# EAGLE design Mechaduino01 (EAGLE 7.7.0)
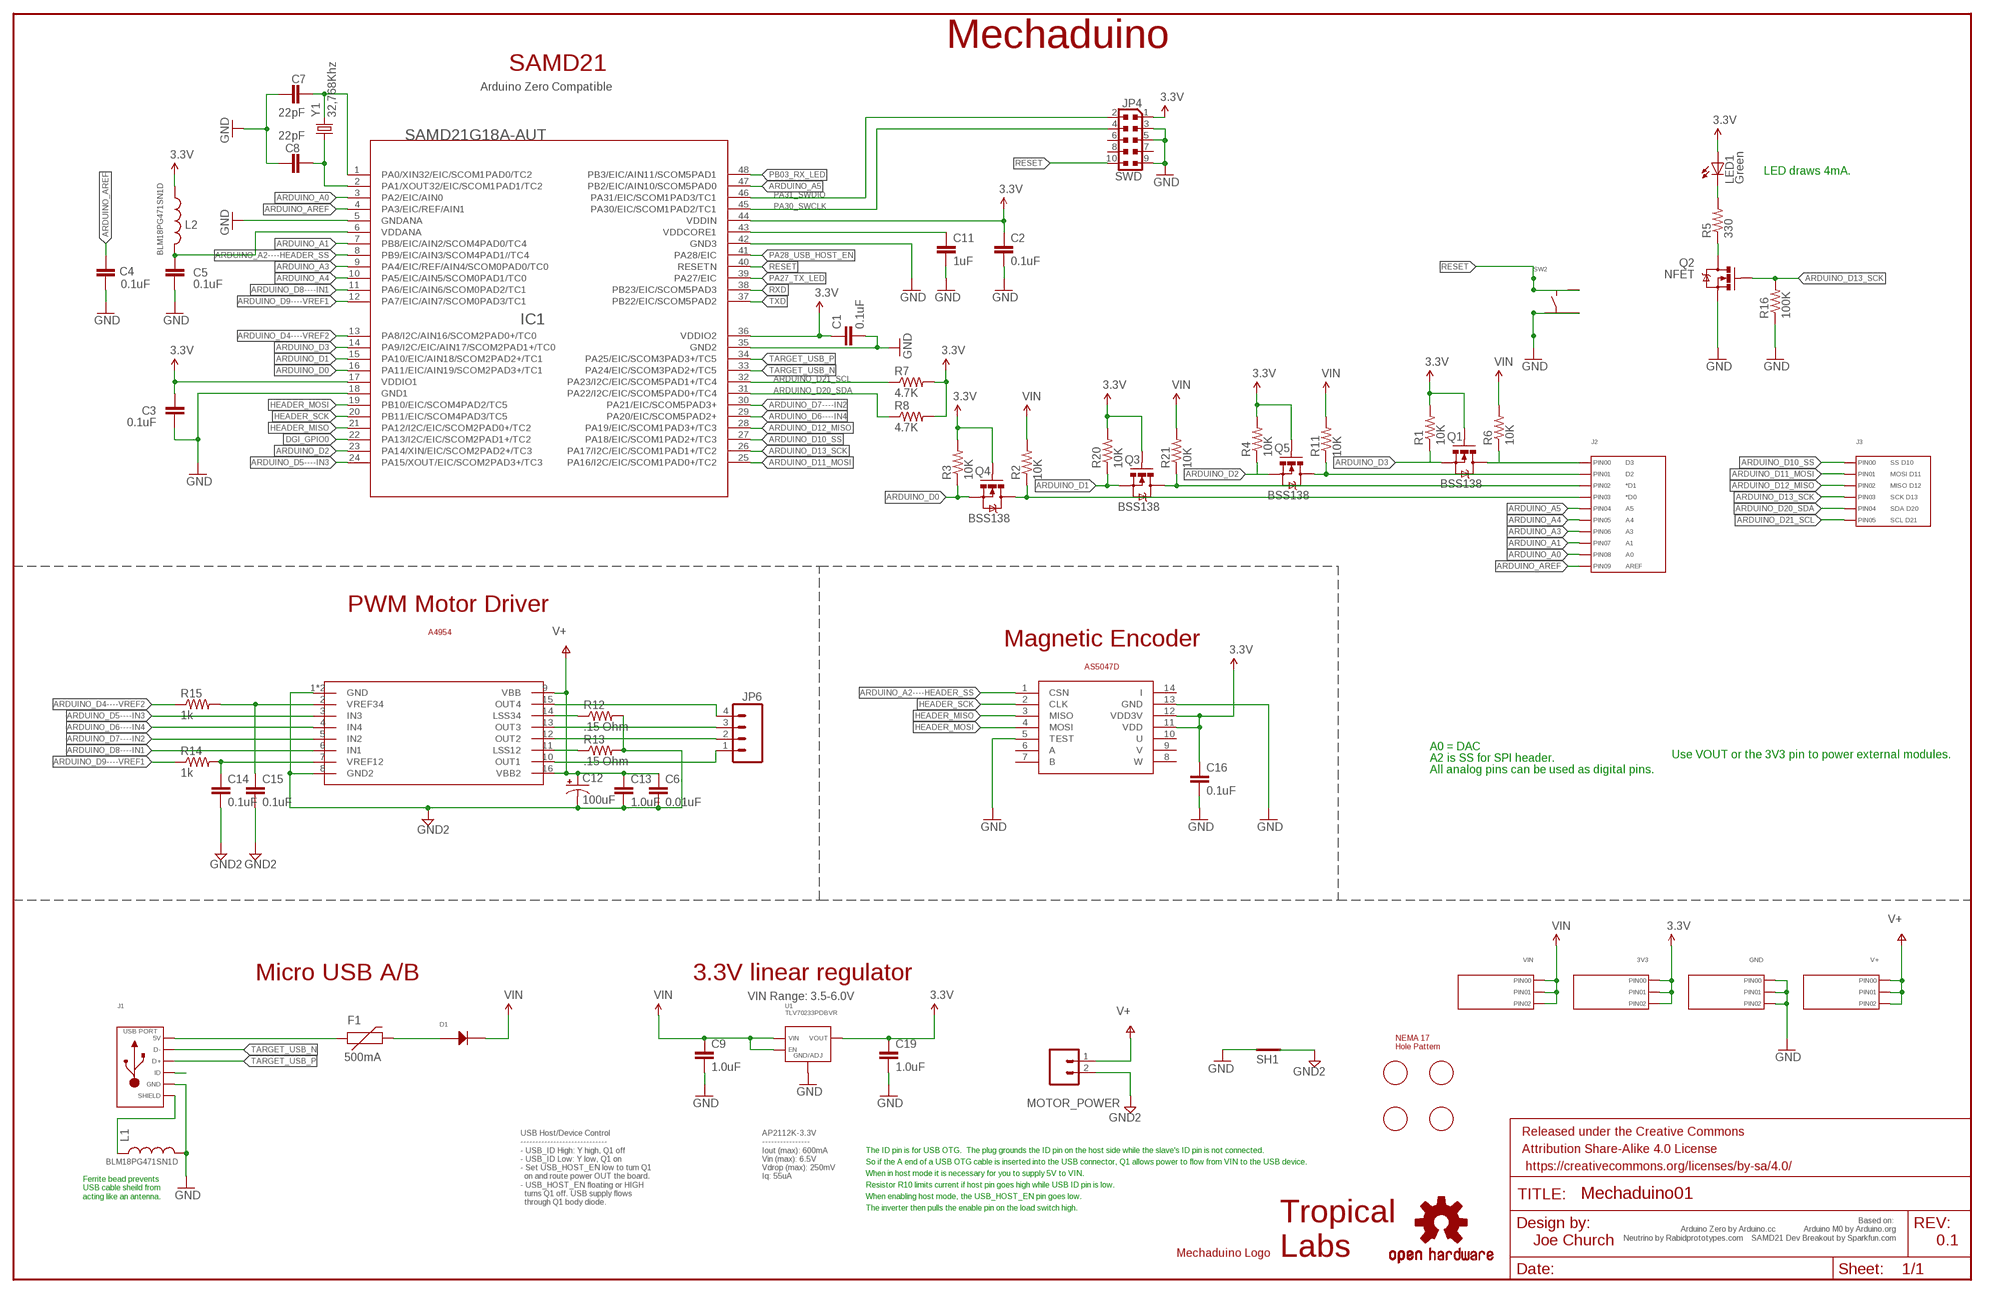
[diagram p0: schematic, sheet 1]

## Parts
3V3  HEADER_01X03_PTH_2.54MM  [PTH_2.54MM_01X03]
C1  0.1uF  CAP0402  [0402-CAP]
C2  0.1uF  CAP0402  [0402-CAP]
C3  0.1uF  CAP0402  [0402-CAP]
C4  0.1uF  CAP0402  [0402-CAP]
C5  0.1uF  CAP0402  [0402-CAP]
C6  0.01uF  CAP0402  [0402-CAP]
C7  22pF  CAP0402  [0402-CAP]
C8  22pF  CAP0402  [0402-CAP]
C9  1.0uF  CAP0402  [0402-CAP]
C11  1uF  CAP0402  [0402-CAP]
C12  100uF  CAP_POLD  [PANASONIC_D]
C13  1.0uF  CAP0603  [0603-CAP]
C14  0.1uF  CAP0402  [0402-CAP]
C15  0.1uF  CAP0402  [0402-CAP]
C16  0.1uF  CAP0402  [0402-CAP]
C19  1.0uF  CAP0402  [0402-CAP]
D1  DIODE_SOD-123  [SOD-123]
F1  500mA  PTCSMD  [PTC-1206]
FRAME1  FRAME-LEDGER  [CREATIVE_COMMONS]
GND  HEADER_01X03_PTH_2.54MM  [PTH_2.54MM_01X03]
IC1  SAMD21G18A-AUT  INTEGRATEDCIRCUITS_1792_SAMD21G18A-AUT  [INTEGRATEDCIRCUITS_TQFP48-7X7]
J1  USB_MICRO_RIGHT  [MICROUSB-RIGHT]
J2  HEADER_01X10_PTH_2.54MM  [PTH_2.54MM_01X10]
J3  HEADER_01X06_PTH_2.54MM  [PTH_2.54MM_01X06]
JP4  SWD  CONNETTORI_0171_PH127-205DF055G00A  [CONNETTORI_PINHEAD-2X5-P127]
JP6  M04PTH  [1X04]
L1  BLM18PG471SN1D  INDUCTOR0603-TDK  [0603-TDK]
L2  BLM18PG471SN1D  INDUCTOR0603-TDK  [0603-TDK]
LED1  Green  0044_KPT-2012YC  [CHIPLED_0805]
LOGO4  OSHW-LOGOL-COPPER  [OSHW-LOGO-L_COPPER]
MOTOR_POWER  M025MM  [SCREWTERMINAL-5MM-2]
Q1  BSS138  MOSFET-NCHANNELSMD  [SOT23-3]
Q2  NFET  MOSFET-NCHANNEL2N7002PW  [SOT323]
Q3  BSS138  MOSFET-NCHANNELSMD  [SOT23-3]
Q4  BSS138  MOSFET-NCHANNELSMD  [SOT23-3]
Q5  BSS138  MOSFET-NCHANNELSMD  [SOT23-3]
R1  10K  R-US_R0402-VISHAY  [R0402-VISHAY]
R2  10K  R-US_R0402-VISHAY  [R0402-VISHAY]
R3  10K  R-US_R0402-VISHAY  [R0402-VISHAY]
R4  10K  R-US_R0402-VISHAY  [R0402-VISHAY]
R5  330  R-US_R0402-VISHAY  [R0402-VISHAY]
R6  10K  R-US_R0402-VISHAY  [R0402-VISHAY]
R7  4.7K  R-US_R0402-VISHAY  [R0402-VISHAY]
R8  4.7K  R-US_R0402-VISHAY  [R0402-VISHAY]
R11  10K  R-US_R0402-VISHAY  [R0402-VISHAY]
R12  .15 Ohm  R-US_R1206  [R1206]
R13  .15 Ohm  R-US_R1206  [R1206]
R14  1k  R-US_R0402-VISHAY  [R0402-VISHAY]
R15  1k  R-US_R0402-VISHAY  [R0402-VISHAY]
R16  100K  R-US_R0402-VISHAY  [R0402-VISHAY]
R20  10K  R-US_R0402-VISHAY  [R0402-VISHAY]
R21  10K  R-US_R0402-VISHAY  [R0402-VISHAY]
SH1  SHORT-HA5  [SHORT_ALL-50]
SW2  TACT_4.2MM  [TACT4.2MM]
U1  TLV70233PDBVR  [SOT-23-5]
U$1  AVAGO_DRIVERTHERM  [TSSOP16_THERM]
U$2  NEMA17_HOLE_PATTERNNEW  [NEMA17_HOLE_PATTERN_2]
U$3  TROPICAL_LABS_LOGO_1LOGO3  [LOGO3]
U$4  AS5047D  [TSSOP14]
U$5  MECHADUINO_LOGO  [MECHADUINO_LOGO]
V+  HEADER_01X03_PTH_2.54MM  [PTH_2.54MM_01X03]
VIN  HEADER_01X03_PTH_2.54MM  [PTH_2.54MM_01X03]
Y1  32,768Khz  CRYSTAL2012  [CRYSTAL-SMD-2.0X1.2]

## Nets
3.3V: 3V3.P$1(PIN0) 3V3.P$2(PIN1) 3V3.P$3(PIN2) C1.1 C2.1 C3.2 C16.1 C19.1 IC1.17(VDDIO1) IC1.36(VDDIO2) IC1.44(VDDIN) JP4.1 L2.1 LED1.A Q1.1(G) Q3.1(G) Q4.1(G) Q5.1(G) R1.2 R3.2 R4.2 R7.2 R8.2 R20.2 U1.P$5(VOUT) U$4.11(VDD) U$4.12(VDD3V)
ARDUINO_A0: IC1.3(PA2/EIC/AIN0) J2.P$9(PIN8)
ARDUINO_A1: IC1.7(PB8/EIC/AIN2/SCOM4PAD0/TC4) J2.P$8(PIN7)
ARDUINO_A2----HEADER_SS: IC1.8(PB9/EIC/AIN3/SCOM4PAD1//TC4) U$4.1(CSN)
ARDUINO_A3: IC1.9(PA4/EIC/REF/AIN4/SCOM0PAD0/TC0) J2.P$7(PIN6)
ARDUINO_A4: IC1.10(PA5/EIC/AIN5/SCOM0PAD1/TC0) J2.P$6(PIN5)
ARDUINO_A5: IC1.47(PB2/EIC/AIN10/SCOM5PAD0) J2.P$5(PIN4)
ARDUINO_AREF: C4.1 IC1.4(PA3/EIC/REF/AIN1) J2.P$10(PIN9)
ARDUINO_D0: IC1.16(PA11/EIC/AIN19/SCOM2PAD3+/TC1) Q4.2(S) R3.1
ARDUINO_D1: IC1.15(PA10/EIC/AIN18/SCOM2PAD2+/TC1) Q3.2(S) R20.1
ARDUINO_D2: IC1.23(PA14/XIN/EIC/SCOM2PAD2+/TC3) Q5.2(S) R4.1
ARDUINO_D3: IC1.14(PA9/I2C/EIC/AIN17/SCOM2PAD1+/TC0) Q1.2(S) R1.1
ARDUINO_D4----VREF2: IC1.13(PA8/I2C/AIN16/SCOM2PAD0+/TC0) R15.1
ARDUINO_D5----IN3: IC1.24(PA15/XOUT/EIC/SCOM2PAD3+/TC3) U$1.3(IN3)
ARDUINO_D6----IN4: IC1.29(PA20/EIC/SCOM5PAD2+) U$1.4(IN4)
ARDUINO_D7----IN2: IC1.30(PA21/EIC/SCOM5PAD3+) U$1.5(IN2)
ARDUINO_D8----IN1: IC1.11(PA6/EIC/AIN6/SCOM0PAD2/TC1) U$1.6(IN1)
ARDUINO_D9----VREF1: IC1.12(PA7/EIC/AIN7/SCOM0PAD3/TC1) R14.1
ARDUINO_D10_SS: IC1.27(PA18/EIC/SCOM1PAD2+/TC3) J3.P$1(PIN0)
ARDUINO_D11_MOSI: IC1.25(PA16/I2C/EIC/SCOM1PAD0+/TC2) J3.P$2(PIN1)
ARDUINO_D12_MISO: IC1.28(PA19/EIC/SCOM1PAD3+/TC3) J3.P$3(PIN2)
ARDUINO_D13_SCK: IC1.26(PA17/I2C/EIC/SCOM1PAD1+/TC2) J3.P$4(PIN3) Q2.1(G) R16.2
ARDUINO_D20_SDA: IC1.31(PA22/I2C/EIC/SCOM5PAD0+/TC4) J3.P$5(PIN4) R8.1
ARDUINO_D21_SCL: IC1.32(PA23/I2C/EIC/SCOM5PAD1+/TC4) J3.P$6(PIN5) R7.1
DGI_GPIO0: IC1.22(PA13/I2C/EIC/SCOM2PAD1+/TC2)
GND [gnd]: C1.2 C2.2 C3.1 C4.2 C5.2 C7.1 C8.1 C9.2 C11.2 C16.2 C19.2 GND.P$1(PIN0) GND.P$2(PIN1) GND.P$3(PIN2) IC1.5(GNDANA) IC1.18(GND1) IC1.35(GND2) IC1.42(GND3) J1.5(GND) JP4.3 JP4.5 JP4.9 L1.2 Q2.2(S) R16.1 SH1.2 SW2.P$3 SW2.P$4 U1.P$2(GND/ADJ) U$4.5(TEST) U$4.13(GND)
GND2 [gnd]: C6.2 C12.- C13.2 C14.2 C15.2 MOTOR_POWER.2 R12.2 R13.2 SH1.1 U$1.1(GND) U$1.8(GND2) U$1.P$1(GND)
HEADER_MISO: IC1.21(PA12/I2C/EIC/SCOM2PAD0+/TC2) U$4.3(MISO)
HEADER_MOSI: IC1.19(PB10/EIC/SCOM4PAD2/TC5) U$4.4(MOSI)
HEADER_SCK: IC1.20(PB11/EIC/SCOM4PAD3/TC5) U$4.2(CLK)
HV1: J2.P$3(PIN2) Q3.3(D) R21.1
HV2: J2.P$4(PIN3) Q4.3(D) R2.1
HV3: J2.P$2(PIN1) Q5.3(D) R11.1
HV4: J2.P$1(PIN0) Q1.3(D) R6.1
N$1: LED1.C R5.2
N$2: R12.1 U$1.14(LSS34)
N$3: Q2.3(D) R5.1
N$4: R13.1 U$1.11(LSS12)
N$6: C15.1 R15.2 U$1.2(VREF34)
N$7: J1.4(ID)
N$13: JP6.4 U$1.15(OUT4)
N$14: JP6.1 U$1.10(OUT1)
N$15: JP6.2 U$1.12(OUT2)
N$16: JP6.3 U$1.13(OUT3)
N$32: C14.1 R14.2 U$1.7(VREF12)
N$33: D1.ANODE F1.2
N$36 [usbvcc]: F1.1 J1.1(5V)
PA00_XIN32: C7.2 IC1.1(PA0/XIN32/EIC/SCOM1PAD0/TC2) Y1.2
PA01_XOUT32: C8.2 IC1.2(PA1/XOUT32/EIC/SCOM1PAD1/TC2) Y1.1
PA27_TX_LED: IC1.39(PA27/EIC)
PA28_USB_HOST_EN: IC1.41(PA28/EIC)
PA30_SWCLK: IC1.45(PA30/EIC/SCOM1PAD2/TC1) JP4.4
PA31_SWDIO: IC1.46(PA31/EIC/SCOM1PAD3/TC1) JP4.2
PB03_RX_LED: IC1.48(PB3/EIC/AIN11/SCOM5PAD1)
RESET: IC1.40(RESETN) JP4.10 SW2.P$1 SW2.P$2
RXD: IC1.38(PB23/EIC/SCOM5PAD3)
SHIELD [gnd]: J1.S1(SLD) J1.S2(SLD) J1.S3(SLD) J1.S4(SLD) J1.S5(SLD) J1.S6(SLD) J1.S7(SLD) J1.S8(SLD) L1.1
TARGET_USB_N [USBpair]: IC1.33(PA24/EIC/SCOM3PAD2+/TC5) J1.2(D-)
TARGET_USB_P [USBpair]: IC1.34(PA25/EIC/SCOM3PAD3+/TC5) J1.3(D+)
TXD: IC1.37(PB22/EIC/SCOM5PAD2)
V+: C6.1 C12.+ C13.1 MOTOR_POWER.1 U$1.9(VBB) U$1.16(VBB2) V+.P$1(PIN0) V+.P$2(PIN1) V+.P$3(PIN2)
VDDANA: C5.1 IC1.6(VDDANA) L2.2
VDDCORE: C11.1 IC1.43(VDDCORE1)
VIN [usbvcc]: C9.1 D1.CATHODE R2.2 R6.2 R11.2 R21.2 U1.P$1(VIN) U1.P$3(EN) VIN.P$1(PIN0) VIN.P$2(PIN1) VIN.P$3(PIN2)
Unconnected: JP4.6 JP4.7 JP4.8 U$4.6(A) U$4.7(B) U$4.8(W) U$4.9(V) U$4.10(U) U$4.14(I)

## Notes on the sheet
- Mechaduino
- SAMD21
- Arduino Zero Compatible
- LED draws 4mA.
- PWM Motor Driver
- A4954
- Magnetic Encoder
- A0 = DAC | Use VOUT or the 3V3 pin to power external modules.
- A2 is SS for SPI header.
- All analog pins can be used as digital pins.
- Micro USB A/B | 3.3V linear regulator
- VIN Range: 3.5-6.0V
- USB Host/Device Control
  -----------------------------
  - USB_ID High: Y high, Q1 off
  - USB_ID Low: Y low, Q1 on
  - Set USB_HOST_EN low to turn Q1
    on and route power OUT the board.
  - USB_HOST_EN floating or HIGH
    turns Q1 off. USB supply flows
    through Q1 body diode.
- AP2112K-3.3V
  ----------------
  Iout (max): 600mA 
  Vin (max): 6.5V
  Vdrop (max): 250mV
  Iq: 55uA
- The ID pin is for USB OTG.  The plug grounds the ID pin on the host side while the slave's ID pin is not connected.
- So if the A end of a USB OTG cable is inserted into the USB connector, Q1 allows power to flow from VIN to the USB device.
- When in host mode it is necessary for you to supply 5V to VIN.
- Resistor R10 limits current if host pin goes high while USB ID pin is low.
- Ferrite bead prevents 
  USB cable sheild from 
  acting like an antenna.
- When enabling host mode, the USB_HOST_EN pin goes low.
- The inverter then pulls the enable pin on the load switch high.
- Based on: 
  Arduino Zero by Arduino.cc              Arduino M0 by Arduino.org
  Neutrino by Rabidprototypes.com    SAMD21 Dev Breakout by Sparkfun.com
- Joe Church | 0.1

## Library data of the parts
3V3 GND V+ VIN = MF_Connectors:HEADER_01X03: Library: MF_Connectors Description: Header Connector with 03 Positions and 01 Rows. Use the LABEL Attribute to label the pin on the schematic and PCB. You can remove the attributes on the PCB by using the SMASH function on the part and then deleting the text.
C1-C9 C11 C13-C16 C19 = swift:CAP: Capacitor Standard 0603 ceramic capacitor, and 0.1" leaded capacitor.
C12 = SparkFun-Capacitors:CAP_POL: Capacitor Polarized These are standard SMD and PTH capacitors. Normally 10uF, 47uF, and 100uF in electrolytic and tantalum varieties. Always verify the external diameter of the through hole cap, it varies with capacity, voltage, and manufacturer. The EIA devices should be standard.
D1 = MF_Discrete_Semiconductor:DIODE: Library: MF_Discrete_Semiconductor Description: Device for Single Packaged Diodes. Manufacture part number (MFG#) can be added via Attributes.; MFG#: N/A
F1 = SparkFun-PowerIC:PTC: Resettable Fuse PTC Resettable Fuse. Spark Fun Electronics SKU : COM-08357; PROD_ID: RES-11150
FRAME1 = SparkFun-Aesthetics:FRAME-LEDGER: Schematic Frame Standard 11x14 US Ledger frame
IC1 = Arduino-Neutrino-082:INTEGRATEDCIRCUITS_1792_SAMD21G18A-AUT: Atmel D21 32bit ARM Cortex-M0 microcontroller - 48 PIN TQFP 256KB flash memory + 32KB SRAM
J1 = MF_Connectors:USB: Library: MF_Connectors Description: 5 Pin USB Connectors. SLD is the shield connection. Usually tied to ground through a small ferrite bead.
J2 = MF_Connectors:HEADER_01X10: Library: MF_Connectors Description: Header Connector with 10 Positions and 01 Rows. Use the LABEL Attribute to label the pin on the schematic and PCB. You can remove the attributes on the PCB by using the SMASH function on the part and then deleting the text.; LABEL00: D3; LABEL01: D2; LABEL02: *D1; LABEL03: *D0; LABEL04: A5; LABEL05: A4; LABEL06: A3; LABEL07: A1; LABEL08: A0; LABEL09: AREF
J3 = MF_Connectors:HEADER_01X06: Library: MF_Connectors Description: Header Connector with 6 Positions and 01 Rows. Use the LABEL Attribute to label the pin on the schematic and PCB. You can remove the attributes on the PCB by using the SMASH function on the part and then deleting the text.; LABEL00: SS D10; LABEL01: MOSI D11; LABEL02: MISO D12; LABEL03: SCK D13; LABEL04: SDA D20; LABEL05: SCL D21
JP4 = Arduino-Neutrino-082:CONNETTORI_0171_PH127-205DF055G00A: 2x5 PASSO 1,27; VALUE: PINHEAD-2x5-P1.27
JP6 = SparkFun-Connectors:M04: Header 4 Standard 4-pin 0.1" header. Use with straight break away headers (SKU : PRT-00116), right angle break away headers (PRT-00553), swiss pins (PRT-00743), machine pins (PRT-00117), and female headers (PRT-00115). Molex polarized connector foot print use with SKU : PRT-08231 with associated crimp pins and housings. 1MM SMD Version SKU: PRT-10208
L1 L2 = SparkFun-Passives:INDUCTOR: Inductors Basic Inductor/Choke - 0603 and 1206. Footprints are not proven and vary greatly between part numbers. SRN6045- 33uH, 20% 1.4A SDR0403-560KL - 56uH, 10%, 500mA RMS/740mA peak
LED1 = Opto:0044_KPT-2012YC: LED YELLOW - SMD - 0805; MONTHLY_USAGE: _____; PART_NUMBER: KPT-2012YC; PRICE: _____; SUPPLIER: _____; TYPE: Opto; VALUE: Yellow
LOGO4 = SparkFun-Aesthetics:OSHW-LOGO: Open Source Hardware Logo This logo indicates the piece of hardware it is found on incorporates a OSHW license and/or adheres to the definition of open source hardware found here: http://freedomdefined.org/OSHW
MOTOR_POWER = SparkFun-Connectors:M02: Standard 2-pin 0.1" header. Use with - straight break away headers ( PRT-00116) - right angle break away headers (PRT-00553) - swiss pins (PRT-00743) - machine pins (PRT-00117) - female headers (PRT-00115) Molex polarized connector foot print use with: PRT-08233 with associated crimp pins and housings. 2.54_SCREWTERM for use with PRT-10571. 3.5mm Screw Terminal footprints for PRT-08084 5mm Screw Terminal footprints for use with PRT-08432; STOREFRONT_ID: PRT-08432
Q1 Q3-Q5 = SparkFun:MOSFET-NCHANNEL
Q2 = SparkFun-DiscreteSemi:MOSFET-NCHANNEL: Common NMOSFET Parts MFG P/N Store ID Prod ID FDD8780 TRANS-09984 SI7820DN TRANS-11055 FDS6630A IC-08089 2N7002PW TRANS-11151 FQP30N06L COM-10213 TRANS-10060 BSS123LT1G TRANS-08345 BSS138 TRANS-00830 BS170 2N7000; PROD_ID: TRANS-11151
R1-R8 R11-R16 R20 R21 = adafruit:R-US_: RESISTOR, American symbol
SH1 = shorts-old:SHORT-H: Short between two nets; BOM: no
SW2 = MF_Switches:TACT: Library: MF_Switches Description: Device for Tact Switches. Manufacture part number (MFG#) can be added via Attributes.
U1 = MF_IC_Power:TLV702: Manufacturer Part #: TLV702 Manufacturer: Texas Instruments Description: LDO Voltage Regulators
U$1 = avagopack:AVAGO_DRIVER
U$2 = stepper_servo_prototype_1:NEMA17_HOLE_PATTERN
U$3 = stepper_servo_prototype_1:TROPICAL_LABS_LOGO_1
U$4 = stepper_servo_prototype_1:AS5047D
U$5 = stepper_servo_prototype_1:MECHADUINO_LOGO
Y1 = SparkFun-FreqCtrl:CRYSTAL: Various standard crystals. Proven footprints. Spark Fun Electronics SKU : COM-00534

## Net classes
2 gnd: width 0.152 mm, drill 0.305 mm, clearance 0.152 mm
3 usbvcc: width 0.152 mm, drill 0.305 mm, clearance 0.152 mm
4 USBpair: width 0.152 mm, drill 0.305 mm, clearance 0.152 mm

## Board
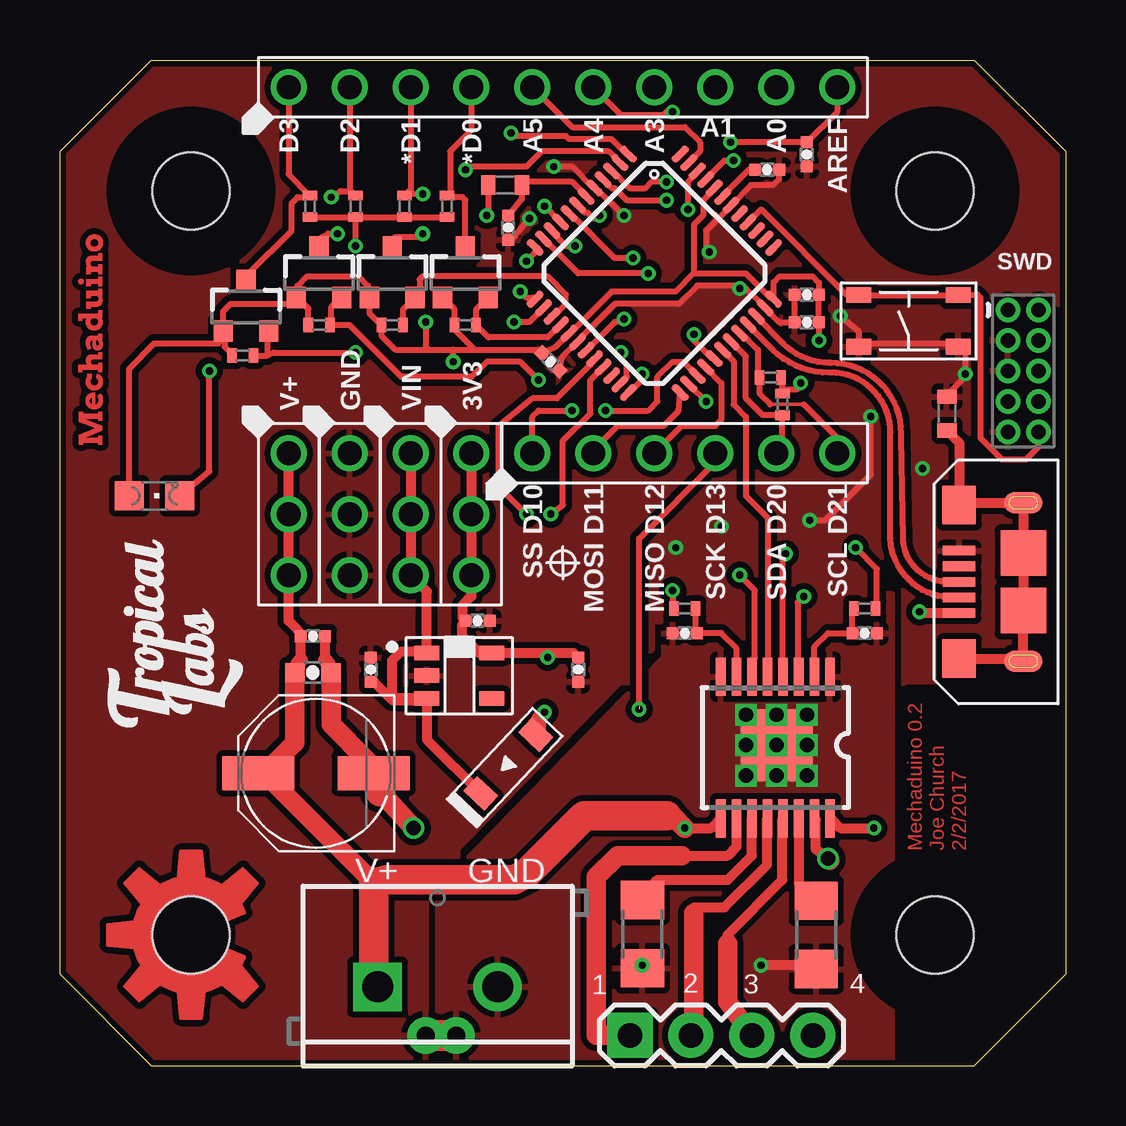
[diagram p1: board, top side]
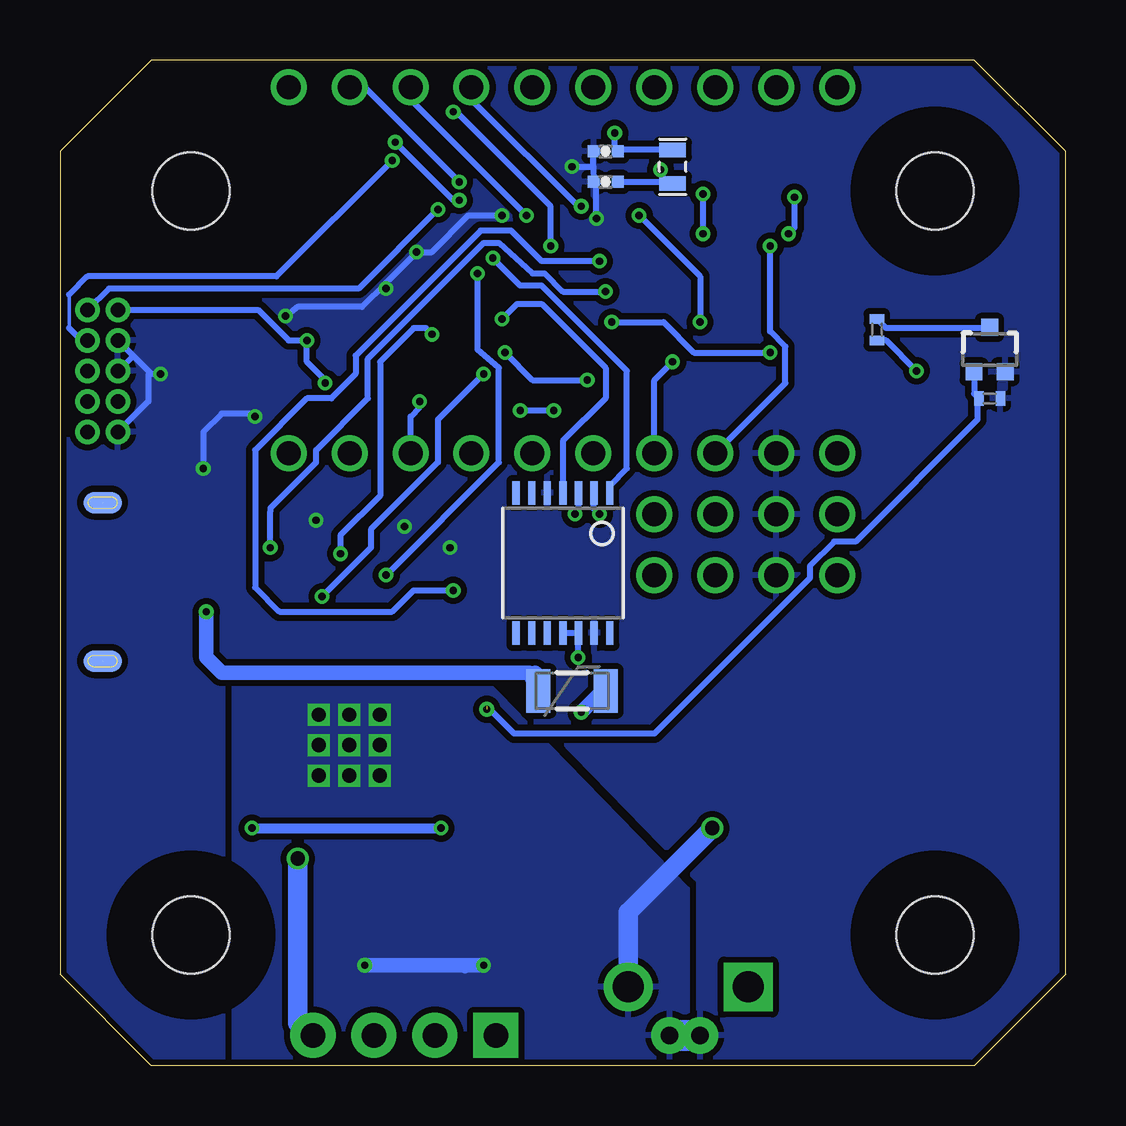
[diagram p2: board, bottom side, seen from below]

Size 41.91 x 41.91 mm. Coordinates in mm from the lower left corner, seen from the top.
Outline: 3.81,0 38.1,0 41.91,3.81 41.91,38.1 38.1,41.91 3.81,41.91 0,38.1 0,3.81 3.81,0
Copper layers (1*16): Top 0.035mm / dielectric 0.2mm / Bottom 0.035mm
Design rules "MacroFabDRU": minimum track width 6mil, minimum drill 12mil, track to track 6mil, track to pad 6mil, pad to pad 6mil, via to via 6mil, smd to smd 0mil, copper to edge 10mil, drill to drill 10mil, minimum pad ring 6mil, minimum via ring 6mil, stop-mask expansion 2mil, vias tented up to drill 25mil, thermal gap 10mil

### Footprints (pad centres in the part's own frame; a part is rotated, then mirrored left to right if it is on the bottom)
PTH_2.54MM_01X03 = drill 1: P$1 -2.54,0; P$2 0,0; P$3 2.54,0
0402-CAP = smd 0.5 x 0.5: 1 -0.5,0; 2 0.5,0
PANASONIC_D = smd 3 x 1.4: + 2.4,0; - -2.4,0
0603-CAP = smd 0.8 x 0.8: 1 -0.75,0; 2 0.75,0
SOD-123 = smd 0.85 x 1.2: ANODE 1.675,0; CATHODE -1.675,0
PTC-1206 = smd 1 x 1.8: 1 -1.4,0; 2 1.4,0
INTEGRATEDCIRCUITS_TQFP48-7X7 = smd 0.85 x 0.32: 1 -4.275,2.75; 2 -4.275,2.25; 3 -4.275,1.75; 4 -4.275,1.25; 5 -4.275,0.75; 6 -4.275,0.25; 7 -4.275,-0.25; 8 -4.275,-0.75; 9 -4.275,-1.25; 10 -4.275,-1.75; 11 -4.275,-2.25; 12 -4.275,-2.75; 25 4.275,-2.75; 26 4.275,-2.25; 27 4.275,-1.75; 28 4.275,-1.25; 29 4.275,-0.75; 30 4.275,-0.25; 31 4.275,0.25; 32 4.275,0.75; 33 4.275,1.25; 34 4.275,1.75; 35 4.275,2.25; 36 4.275,2.75 | smd 0.32 x 0.85: 13 -2.75,-4.275; 14 -2.25,-4.275; 15 -1.75,-4.275; 16 -1.25,-4.275; 17 -0.75,-4.275; 18 -0.25,-4.275; 19 0.25,-4.275; 20 0.75,-4.275; 21 1.25,-4.275; 22 1.75,-4.275; 23 2.25,-4.275; 24 2.75,-4.275; 37 2.75,4.275; 38 2.25,4.275; 39 1.75,4.275; 40 1.25,4.275; 41 0.75,4.275; 42 0.25,4.275; 43 -0.25,4.275; 44 -0.75,4.275; 45 -1.25,4.275; 46 -1.75,4.275; 47 -2.25,4.275; 48 -2.75,4.275
MICROUSB-RIGHT = smd 0.4 x 1.35: 1 -1.3,1.27; 2 -0.65,1.27; 3 0,1.27; 4 0.65,1.27; 5 1.3,1.27 | smd 0.9 x 1.6: S1 -3.3,-1.4; S2 3.3,-1.4 | smd 1.6 x 1.4: S3 -3.2,1.27; S4 3.2,1.27 | smd 1.9 x 1.9: S5 -1.2,-1.405; S6 1.2,-1.405 | smd 0.9 x 1.6 bottom: S7 -3.3,-1.4; S8 3.3,-1.4
PTH_2.54MM_01X10 = drill 1: P$1 -11.43,0; P$2 -8.89,0; P$3 -6.35,0; P$4 -3.81,0; P$5 -1.27,0; P$6 1.27,0; P$7 3.81,0; P$8 6.35,0; P$9 8.89,0; P$10 11.43,0
PTH_2.54MM_01X06 = drill 1: P$1 -6.35,0; P$2 -3.81,0; P$3 -1.27,0; P$4 1.27,0; P$5 3.81,0; P$6 6.35,0
CONNETTORI_PINHEAD-2X5-P127 = drill 0.61 pad 1.016: 1 -0.635,2.54; 2 0.635,2.54; 3 -0.635,1.27; 4 0.635,1.27; 5 -0.635,0; 6 0.635,0; 7 -0.635,-1.27; 8 0.635,-1.27; 9 -0.635,-2.54; 10 0.635,-2.54
1X04 = drill 1.016 pad 1.88 square: 1 0,0 | drill 1.016 pad 1.88: 2 2.54,0; 3 5.08,0; 4 7.62,0
0603-TDK = smd 0.6 x 0.8: 1 -0.7,0; 2 0.7,0
CHIPLED_0805 = smd 1.2 x 1.2: A 0,-1.05; C 0,1.05
SCREWTERMINAL-5MM-2 = drill 1.3 pad 2.032 square: 1 0,0 | drill 1.3 pad 2.032: 2 5,0
SOT23-3 = smd 0.8 x 0.9: 1 -0.95,-1; 2 0.95,-1; 3 0,1.1
SOT323 = smd 0.7 x 0.7: 1 -0.65,-0.925; 2 0.65,-0.925; 3 0,0.925
R0402-VISHAY = smd 0.4 x 0.6: 1 -0.45,0; 2 0.45,0
R1206 = smd 1.6 x 1.803: 1 -1.422,0; 2 1.422,0
SHORT_ALL-50 = drill 0.737 pad 1.524: 1 -0.635,0; 2 0.635,0
TACT4.2MM = smd 1.05 x 0.65: P$1 -2.075,1.075; P$2 2.075,1.075; P$3 -2.075,-1.075; P$4 2.075,-1.075
SOT-23-5 = smd 1.05 x 0.6: P$1 -1.35,0.95; P$2 -1.35,0; P$3 -1.35,-0.95; P$4 1.35,-0.95; P$5 1.35,0.95
TSSOP16_THERM = smd 0.4 x 1.6: 1 -2.225,-2.85; 2 -1.575,-2.85; 3 -0.925,-2.85; 4 -0.275,-2.85; 5 0.375,-2.85; 6 1.025,-2.85; 7 1.675,-2.85; 8 2.325,-2.85; 9 2.325,3.05; 10 1.675,3.05; 11 1.025,3.05; 12 0.375,3.05; 13 -0.275,3.05; 14 -0.925,3.05; 15 -1.575,3.05; 16 -2.225,3.05 | smd 3 x 3: P$1 0,0
NEMA17_HOLE_PATTERN_2 = hole 3.2: -15.5,15.5; -15.5,-15.5; 15.5,-15.5; 15.5,15.5
TSSOP14 = smd 0.305 x 0.991: 1 -1.95,-2.918; 2 -1.3,-2.918; 3 -0.65,-2.918; 4 0,-2.918; 5 0.65,-2.918; 6 1.3,-2.918; 7 1.95,-2.918; 8 1.95,2.918; 9 1.3,2.918; 10 0.65,2.918; 11 0,2.918; 12 -0.65,2.918; 13 -1.3,2.918; 14 -1.95,2.918
CRYSTAL-SMD-2.0X1.2 = smd 0.6 x 1.1: 1 -0.7,0; 2 0.7,0

### Placement (x,y rotation side)
3V3  17.14,22.99 270 top
C1  31.11,32.13 180 top
C2  31.11,30.99 180 top
C3  20.45,29.34 135 top
C4  31.11,37.97 270 top
C5  18.67,34.92 270 top
C6  10.54,17.91 0 top
C7  18pF  [0402-CAP]  19.18,38.1 0 bottom
C8  18pF  [0402-CAP]  19.18,36.83 0 bottom
C9  12.95,16.51 90 top
C11  29.46,37.34 0 top
C12  10.67,12.19 180 top
C13  10.54,16.38 0 top
C14  26.04,18.03 180 top
C15  33.53,18.03 0 top
C16  21.59,16.51 270 top
C19  17.4,18.54 0 top
D1  18.67,12.57 46.8 top
F1  20.57,15.62 0 bottom
FRAME1  0.61,-10.16 0 top  (outside the outline)
GND  12.06,22.99 270 top
IC1  24.77,33.02 315 top
J1  38.73,20.17 90 top
J2  20.95,40.77 0 top
J3  26.04,25.53 0 top
JP4  40.13,28.96 0 top
JP6  23.75,1.27 0 top
L1  36.96,27.18 90 top
L2  18.54,36.7 0 top
LED1  3.94,23.75 270 top
LOGO4  5.46,5.46 90 top
MOTOR_POWER  13.23,3.29 0 top
Q1  7.75,31.62 0 top
Q2  3.17,29.84 0 bottom
Q3  13.84,33.02 0 top
Q4  16.89,33.02 0 top
Q5  10.79,33.02 0 top
R1  7.62,29.59 180 top
R2  16.13,35.81 270 top
R3  16.89,30.86 180 top
R4  10.79,30.86 180 top
R5  7.87,30.67 270 bottom
R6  10.41,35.81 270 top
R7  29.59,28.68 0 top
R8  30.1,27.56 90 top
R11  12.32,35.81 270 top
R12  31.51,5.46 270 top
R13  24.27,5.49 270 top
R14  26.04,19.05 0 top
R15  33.53,19.05 180 top
R16  3.17,27.81 180 bottom
R20  13.84,30.86 180 top
R21  14.35,35.81 270 top
SH1  15.88,1.27 180 top
SW2  35.36,31.04 0 top
U1  16.64,16.26 0 top
U$1  29.86,13.36 180 top
U$2  20.95,20.95 0 top
U$3  7.75,13.97 90 top
U$4  20.95,20.95 180 bottom
U$5  1.91,25.78 90 top
V+  9.53,22.99 270 top
VIN  14.61,22.99 270 top
Y1  16.38,37.47 90 bottom

### Tracks (layer width: path | path; a pad name or v marks a point on that pad's centre or on a via)
3.3V  (via drill 0.3, 0.3 pad 0.25)
  Top 0.254: 30.1,28.19 30.1,28.75 R7.2 | v30.86,28.45 30.73,28.19 30.1,28.19 | 30.1,28.19 R8.2 | 31.62,30.99 v31.62,30.23 | C2.1 31.62,30.99 | 31.62,30.99 31.62,32.12 C1.1 31.62,32.14 31.62,32.64 31.37,32.89 29.97,32.89 29.73,32.65 IC1.36 29.72,32 29.59,32 28.57,33.02 26.42,33.02 | Q4.1 16.44,31.52 R3.2 16.44,30.68 17.27,29.84 | 17.27,29.84 19.94,29.84 C3.2 20.63,29.95 IC1.17 21.34,30.61 22.99,32.26 25.65,32.26 26.42,33.02 | R4.2 10.35,31.52 | 10.35,31.52 Q5.1 9.57,31.75 7.11,31.75 6.8,31.43 Q1.1 6.86,30.86 6.86,30.35 | 10.35,31.52 10.35,31.57 9.91,32 9.91,32.51 10.29,32.89 12.45,32.89 12.83,32.51 12.83,32.09 Q3.1 12.89,31.36 R20.2 13.39,30.42 13.97,29.84 15.37,29.84 | 15.37,29.84 16.38,29.84 | 16.38,29.84 17.27,29.84 | L2.1 17.84,35.62 17.72,35.5 | 17.72,35.5 17.65,35.43 | v17.78,35.43 17.72,35.5 | v15.24,30.99 15.24,29.97 15.37,29.84 | 6.86,30.35 6.86,29.97 7.11,29.72 R1.2 | LED1.A 2.89,29.05 3.94,30.1 6.6,30.1 6.86,30.35 | v16.38,29.34 16.38,29.84 | 26.42,33.02 26.42,35.05 26.8,35.43 26.8,36.07 27.18,36.45 IC1.44 | v20.32,17.02 20.32,17.21
  Top 0.406: 3V3.P$1 3V3.P$2 3V3.P$3 17.14,19.56 16.76,19.18 16.76,18.68 C19.1 16.76,18.41 16.76,17.91 17.46,17.21 U1.P$5 20.32,17.21 21.39,17.21 C16.1
  Bottom 0.254: v30.86,28.45 30.86,28.57 31.62,29.34 v31.62,30.23 32.38,30.23 33.66,31.5 JP4.1 | v15.24,30.99 15.24,32.89 v17.78,35.43 | v16.38,29.34 17.14,28.57 3V3.P$1 | v20.32,17.02 20.32,18.03 U$4.12 20.45,18.03 U$4.11
ARDUINO_A0  (via drill 0.3 pad 0.25)
  Top 0.254: IC1.3 22.99,37.34 23.75,36.58 24.38,36.58 24.64,36.83 v25.27,36.83
  Bottom 0.254: v25.27,36.83 29.21,40.77 J2.P$9
ARDUINO_A1  (via drill 0.3 pad 0.25)
  Top 0.254: v22.48,35.43 22.35,35.43 22.23,35.31 21.97,35.56 21.84,35.56 21.59,35.81 IC1.7
  Bottom 0.254: J2.P$8 27.3,40.26 v22.48,35.43
ARDUINO_A2----HEADER_SS  (via drill 0.3 pad 0.25)
  Top 0.254: v23.88,33.66 23.11,33.66 21.34,35.43 IC1.8
  Bottom 0.254: U$4.1 19,24.18 18.29,24.89 18.29,28.96 21.84,32.51 22.73,32.51 v23.88,33.66
ARDUINO_A3  (via drill 0.3 pad 0.25)
  Top 0.254: v20.19,35.81 20.83,35.18 IC1.9
  Bottom 0.254: J2.P$7 24.77,40.26 20.19,35.69 v20.19,35.81
ARDUINO_A4  (via drill 0.3 pad 0.25)
  Top 0.254: v25.53,39.75 25.27,39.75 25.15,39.62 23.37,39.62 J2.P$6 | v21.46,34.16 21.08,34.16 20.45,34.8 IC1.10
  Bottom 0.254: v25.53,39.75 25.4,39.75 21.46,35.81 v21.46,34.16
ARDUINO_A5
  Top 0.254: J2.P$5 21.34,39.12 26.04,39.12 26.67,38.48 26.67,38.1 IC1.47
ARDUINO_AREF  (via drill 0.3 pad 0.25)
  Top 0.254: J2.P$10 32.38,39.74 C4.1 31.11,38.48 v27.94,38.48 | v25.27,36.07 23.62,36.07 23.11,36.58 22.99,36.58 22.73,36.83 IC1.4
  Bottom 0.254: v25.27,36.07 25.53,36.07 v27.94,38.48
ARDUINO_D0
  Top 0.254: Q4.2 17.34,31.52 R3.1 17.85,30.35 20.32,30.35 20.85,30.88 IC1.16
ARDUINO_D1
  Top 0.254: R20.1 14.29,31.52 Q3.2 14.99,32.21 14.99,32.77 15.11,32.89 20.32,32.89 21.08,32.13 21.08,31.75 20.57,31.23 IC1.15 20.44,31.23
ARDUINO_D2  (via drill 0.3 pad 0.25)
  Top 0.254: 23.24,28.32 IC1.23 23.37,28.45 23.62,28.7 23.62,29.21 23.37,29.46 v23.37,29.72 | 11.3,30.86 12.06,30.86 14.22,28.7 17.14,28.7 17.78,29.34 19.18,29.34 v19.94,28.57 | 11.3,30.86 11.3,31.62 11.68,32 Q5.2 | 11.3,30.86 R4.1
  Bottom 0.254: v19.94,28.57 22.23,28.57 v23.37,29.72
ARDUINO_D3  (via drill 0.3 pad 0.25)
  Top 0.254: IC1.14 19.56,30.99 v18.92,30.99 | 8.64,30.86 Q1.2 8.64,30.73 8.64,29.59 | R1.1 8.64,29.59 | 8.64,29.59 8.89,29.72 v12.32,29.72
  Bottom 0.254: v12.32,29.72 15.49,29.72 16.76,30.99 v18.92,30.99
ARDUINO_D4----VREF2  (via drill 0.3 pad 0.25)
  Top 0.254: v33.15,21.59 34.04,20.7 34.04,19.05 R15.1 | v19.18,32.26 19.43,32 19.68,32 IC1.13
  Bottom 0.254: v33.15,21.59 33.15,23.11 33.15,23.24 31.24,25.15 31.24,25.65 29.08,27.81 29.08,29.46 24.26,34.29 23.62,34.29 22.23,33.02 21.72,33.02 20.95,32.26 v19.18,32.26
ARDUINO_D5----IN3  (via drill 0.3 pad 0.25)
  Top 0.254: v24.26,28.83 24.38,28.7 23.75,28.07 IC1.24 | v30.99,19.56 30.73,19.3 30.73,16.26 U$1.3
  Bottom 0.254: v24.26,28.83 26.16,26.92 26.16,25.15 28.96,22.35 28.96,21.59 v30.99,19.56
ARDUINO_D6----IN4  (via drill 0.3 pad 0.25)
  Top 0.254: v26.42,30.48 26.29,30.35 27.18,29.46 IC1.29 | v30.23,21.34 30.1,21.08 30.1,16.26 U$1.4
  Bottom 0.254: v26.42,30.48 26.67,30.73 27.18,30.73 28.57,29.34 28.57,23.75 30.23,22.1 v30.23,21.34
ARDUINO_D7----IN2
  Top 0.254: 29.46,16.26 U$1.5 | 29.46,16.23 U$1.5 | IC1.30 28.07,29.36 28.07,27.56 28.57,27.05 28.57,23.75 29.48,22.84 U$1.5
ARDUINO_D8----IN1  (via drill 0.3 pad 0.25)
  Top 0.203: U$1.6
  Top 0.254: v28.32,20.45 28.96,19.81 28.96,17.02 28.83,16.89 28.83,16.26 U$1.6 | v24.51,33.02 21.59,33.02 20.19,34.42 IC1.11
  Bottom 0.254: v24.51,33.02 24.51,29.84 23.62,29.08 23.62,25.15 v28.32,20.45
ARDUINO_D9----VREF1  (via drill 0.3 pad 0.25)
  Top 0.254: v19.43,33.53 19.94,34.04 19.81,34.16 IC1.12 | v25.53,19.81 25.53,19.05 R14.1
  Bottom 0.254: v19.43,33.53 21.84,33.53 23.11,34.8 24.38,34.8 29.59,29.59 29.59,28.83 30.61,27.81 31.62,27.81 33.78,25.65 33.78,19.94 32.77,18.92 28.07,18.92 27.18,19.81 v25.53,19.81
ARDUINO_D10_SS  (via drill 0.3 pad 0.25)
  Top 0.254: IC1.27 25.97,29.34 25.53,29.34 24.89,28.7 24.89,27.69 24.51,27.3 v22.73,27.3 | J3.P$1 19.68,27.05 19.94,27.3 v21.34,27.3
  Bottom 0.254: v21.34,27.3 v22.73,27.3
ARDUINO_D11_MOSI
  Top 0.254: J3.P$2 22.23,25.65 23.24,26.67 25.1,26.67 25.15,26.67 25.78,27.3 IC1.25
ARDUINO_D12_MISO
  Top 0.254: IC1.28 26.92,29.08 27.56,28.45 27.56,26.92 27.3,26.67 25.91,26.67 J3.P$3
ARDUINO_D13_SCK  (via drill 0.3 pad 0.25)  (1 unrouted)
  Top 0.254: v26.92,27.69 26.29,28.32 IC1.26 | J3.P$4 27.3,25.15 24.13,21.97 v24.13,14.86
  Bottom 0.254: J3.P$4 27.3,27.05 26.92,27.43 v26.92,27.69 | Q2.1 3.83,28.01 R16.2 3.68,27.81 3.68,26.92 8.76,21.84 9.65,21.84 10.67,20.83 10.67,20.32 17.14,13.84 22.99,13.84 24.13,14.99
ARDUINO_D20_SDA
  Top 0.254: IC1.31 28.57,29.56 28.57,27.81 29.28,27.11 R8.1 30.1,25.78 J3.P$5
ARDUINO_D21_SCL
  Top 0.152: 29.59,27.56 30.99,27.56
  Top 0.254: IC1.32 28.32,30.61 29.08,29.84 29.08,28.83 R7.1 29.14,28.01 29.59,27.56 | J3.P$6 32.38,26.16 30.99,27.56
GND  (via drill 0.3, 0.3 pad 0.25)
  Top 0.254: C11.2 29.96,36.95 29.72,36.7 28.8,36.7 IC1.42 27.94,35.81 26.92,34.8 26.92,34.04 v27.05,33.91 | v20.57,37.47 21.34,37.47 22.23,36.58 IC1.5 22.35,36.45 22.48,36.45 v23.5,35.43 | C1.2 C2.2 29.97,30.99 IC1.35 29.34,31.62 28.57,32.38 28.45,32.38 | C3.1 20.93,29.54 IC1.18 21.59,30.23 23.11,31.75 25.78,31.75 26.54,32.51 28.32,32.51 28.45,32.38 | v19.56,35.31 18.92,34.54 18.67,34.54 C5.2 | 28.45,32.38 v28.32,32.38 | L1.2 36.96,27.94 37.78,28.77 v37.72,28.83 37.72,30.1 37.47,30.1 SW2.P$4 37.34,30.1 33.4,30.1 SW2.P$3 33.27,30.61 v32.51,31.24 | v31.24,22.73 31.88,22.73 33.78,24.64 v33.78,27.05
  Bottom 0.254: 19.68,37.47 C7.1 | 19.68,37.47 C8.1 19.56,36.83 v19.56,35.31 | v20.57,37.47 19.68,37.47 | v23.5,35.43 24.89,35.43 26.42,33.91 v27.05,33.91 28.32,32.64 | 28.32,32.64 v28.32,32.38 | v37.72,28.83 38.1,28.83 38.16,28.89 | JP4.3 38.86,29.59 | 38.86,29.59 38.16,28.89 | 38.86,29.59 JP4.5 | JP4.9 38.23,27.69 38.23,28.83 38.16,28.89 | v32.51,31.24 32,31.62 29.34,31.62 28.32,32.64 | v33.78,27.05 33.78,27.18 35.18,27.18 35.94,26.42 v35.94,24.89
  other vias: 27.56,22.48 25.65,21.59
  pour Bottom (isolate 0.254, rank 2): -0.64,-0.64 -0.64,42.55 42.55,42.55 42.55,-0.64
  pour Top (isolate 0.254, rank 2): -0.64,42.55 42.55,42.55 42.55,-0.64 -0.64,-0.64
GND2  (via drill 0.3, 0.6)
  Top 0.406: R12.2 31.5,4.06 31.37,4.19 v29.21,4.19 | v24.26,4.19 R13.2 | 11.05,16.89 C6.2
  Top 0.61: 11.05,16.89 11.18,16.76 C13.2
  Top 0.813: 13.34,11.43 v14.73,9.91 | C13.2 11.3,16.38 11.3,14.22 12.83,12.7 C12.-
  Top 1.219: 13.34,11.43 13.21,11.94 C12.-
  Bottom 0.406: 25.03,4.06 25.02,4.08 v24.26,4.19
  Bottom 0.61: v29.21,4.19 v24.26,4.19
  Bottom 0.813: MOTOR_POWER.2 18.23,6.41 v14.73,9.91
  other vias: 31.13,14.63 31.13,12.09 29.86,14.63 28.59,14.63 28.59,12.09 29.86,12.09 28.59,13.36 29.86,13.36 31.13,13.36
  pour Top (isolate 0.254): 15.75,-0.64 15.75,7.37 25.15,17.02 25.15,19.68 34.67,19.68 34.67,-0.64
  pour Bottom (isolate 0.254): 15.75,-0.64 15.75,7.37 25.15,17.02 25.15,19.68 34.67,19.68 34.67,-0.64
HEADER_MISO  (via drill 0.3 pad 0.25)
  Top 0.254: v20.45,22.99 20.95,23.37 20.95,26.04 22.1,27.18 22.1,28.57 22.61,29.08 IC1.21
  Bottom 0.254: U$4.3 20.32,23.75 20.32,23.11 v20.45,22.99
HEADER_MOSI  (via drill 0.3 pad 0.25)
  Top 0.254: v23.5,31.11 23.11,30.99 21.97,29.84 IC1.19
  Bottom 0.254: U$4.4 20.95,26.04 19.18,27.81 19.18,29.08 21.84,31.75 22.86,31.75 v23.5,31.11
HEADER_SCK  (via drill 0.3 pad 0.25)
  Top 0.254: v19.43,22.99 18.29,24.13 18.29,26.67 19.68,27.81 20.7,27.81 22.1,29.21 22.1,29.34 22.23,29.46 IC1.20
  Bottom 0.254: v19.43,22.99 19.68,23.24 19.68,23.75 U$4.2
HV1  (via drill 0.3 pad 0.25)
  Top 0.254: J2.P$3 14.61,36.52 R21.1 14.61,36.45 14.73,36.32 v15.11,36.32 | v15.11,34.67 14.86,34.54 13.97,34.54 13.84,34.42 Q3.3
  Bottom 0.254: v15.11,34.67 v15.11,36.32
HV2
  Top 0.254: J2.P$4 17.14,38.99 16.26,38.1 16.26,36.39 R2.1 16.2,36.2 16.76,36.2 16.89,36.07 Q4.3
HV3  (via drill 0.3 pad 0.25)
  Top 0.254: J2.P$2 12.06,36.52 R11.1 12.06,36.45 11.68,36.45 v11.3,36.2 | v11.56,34.67 11.18,34.67 10.92,34.54 10.79,34.42 Q5.3
  Bottom 0.254: v11.3,36.2 11.3,34.92 v11.56,34.67
HV4
  Top 0.254: J2.P$1 9.53,37.15 R6.1 10.35,36.2 9.91,36.2 9.65,35.94 9.65,34.8 7.83,32.98 Q1.3
N$1  (via drill 0.3 pad 0.25)
  Top 0.254: LED1.C 6.22,24.77 v6.22,28.96
  Bottom 0.254: v6.22,28.96 7.49,30.23 R5.2
N$2
  Top 0.406: U$1.14 30.78,7.6 R12.1
N$3
  Bottom 0.254: Q2.3 3.27,30.77 3.3,30.73 7.49,30.73 R5.1
N$4
  Top 0.406: R13.1 24.18,6.91 24.89,7.75 27.81,7.75 28.83,8.76 U$1.11
N$6
  Top 0.254: U$1.2 31.43,17.46 32,18.03 C15.1 | C15.1 33.02,19.05 R15.2 | C15.1
N$13  (via drill 0.6)
  Top 0.406: 32.07,8.56 31.5,9.02 31.5,10.25 U$1.15
  Top 0.813: v32,8.64 32.07,8.56
  Bottom 0.813: v32,8.64 32,1.78 31.5,1.27 JP6.4
N$14
  Top 0.406: 25.91,8.76 27.81,8.76 28.19,9.14 28.19,10.3 U$1.10
  Top 0.813: JP6.1 22.35,1.27 22.35,7.87 23.24,8.76 25.91,8.76
N$15
  Top 0.406: 26.42,6.35 26.42,6.6 27.69,6.6 29.46,8.38 29.46,10.29 U$1.12
  Top 0.813: JP6.2 26.42,1.4 26.42,6.35
N$16
  Top 0.406: 27.81,2.67 27.81,5.46 30.1,7.75 30.1,10.28 U$1.13
  Top 0.813: JP6.3 27.81,2.67 27.81,5.08
N$32
  Top 0.254: U$1.7 28.19,16.22 28.19,17.4 27.56,18.03 C14.1 26.48,18.08 R14.2
N$33  (via drill 0.3)
  Top 0.61: v20.19,14.73 19.94,14.48 19.94,13.84 D1.ANODE
  Bottom 0.61: v20.19,14.73 19.18,15.75 19.05,15.62 F1.2
N$36  (via drill 0.3)
  Top 0.406: J1.1 35.88,18.87 v35.81,18.92
  Bottom 0.61: 22.1,16.38 21.97,16.26 F1.1 22.35,16.38 35.18,16.38 35.81,17.02 v35.81,18.92
PA00_XIN32  (via drill 0.3 pad 0.25)
  Top 0.254: IC1.1 23.62,37.97 22.99,38.61 21.21,38.61 21.08,38.73 18.8,38.73 v18.8,38.86
  Bottom 0.254: v18.8,38.86 18.8,38.1 C7.2 18.61,38.16 Y1.2
PA01_XOUT32  (via drill 0.3 pad 0.25)
  Top 0.254: v16.89,37.34 17.14,37.47 19.43,37.47 20.07,38.1 22.86,38.1 23.24,37.72 IC1.2
  Bottom 0.254: C8.2 16.76,36.83 | v16.89,37.34 16.76,36.83 | 16.76,36.83 16.45,36.83 Y1.1
PA30_SWCLK  (via drill 0.3 pad 0.25)
  Top 0.254: v28.07,37.72 27.69,37.72 26.92,36.96 IC1.45
  Bottom 0.152: 41.53,32.13 41.53,30.73
  Bottom 0.254: v28.07,37.72 32.89,32.89 40.77,32.89 41.53,32.13 | 41.53,30.73 41.02,30.23 JP4.4
PA31_SWDIO  (via drill 0.3 pad 0.25)
  Top 0.254: v26.16,35.69 26.16,36.83 26.54,37.21 IC1.46
  Bottom 0.254: v26.16,35.69 29.46,32.38 39.88,32.38 JP4.2
RESET
  Top 0.254: IC1.40 28.7,35.18 29.21,35.69 32.77,32.13 SW2.P$1 SW2.P$2 37.47,32.13 38.23,32.13 38.35,32 38.35,26.16 39.24,25.27 40.26,25.27 40.77,25.78 JP4.10
SHIELD  (2 unrouted)
  Top 0.305: 40.42,16.87 J1.S1 | 40.13,18.99 J1.S5
  Top 0.406: 40.13,18.99 J1.S1 40.42,16.97 J1.S3 | L1.1 37.47,25.97 J1.S4 37.56,23.47 J1.S8 J1.S6 J1.S5
TARGET_USB_N
  Top 0.254: J1.2 37.3,19.52 arc-90 34.59,21.97 34.59,26.42 arc90 32.13,28.88 32.07,28.88 arc-45 29.7,29.83 28.78,30.75 IC1.33
TARGET_USB_P
  Top 0.254: J1.3 37.06,20.17 arc-90 35.13,21.97 35.05,26.16 35.05,26.36 arc90 32.13,29.29 32.07,29.29 arc-45 30.12,30.12 29.02,31.21 IC1.34
V+  (via drill 0.3)
  Top 0.406: v26.04,9.91 27.13,9.91 U$1.9 | U$1.16 32.11,10.31 32.51,9.91 v33.91,9.91 | 10.03,16.89 C6.1 | C6.1 | C6.1 9.91,18.16 9.53,18.54 V+.P$3 V+.P$2 V+.P$1
  Top 0.61: 10.03,16.89 9.91,16.76 C13.1
  Top 0.813: C12.+ 8.76,12.19 | 13.21,3.3 MOTOR_POWER.1 | C13.1 9.78,13.46 8.89,12.57 C12.+ | 13.08,7.62 8.89,11.81 C12.+ | v26.04,9.91 25.53,10.41 25.27,10.41
  Top 1.219: MOTOR_POWER.1 13.08,3.68 13.08,7.62 13.59,7.75 18.92,7.75 19.43,8 21.84,10.41 25.27,10.41
  Bottom 0.406: v33.91,9.91 v26.04,9.91
VDDANA
  Top 0.254: C5.1 19.24,36.12 L2.2 19.3,36.83 21.34,36.83 21.92,36.25 IC1.6
VDDCORE
  Top 0.254: IC1.43 27.61,36.25 28.7,37.34 C11.1
VIN  (via drill 0.3 pad 0.25)
  Top 0.254: R6.2 R11.2 | R11.2 R21.2 R2.2 | v12.32,34.16 R11.2
  Top 0.406: C9.1 13.07,16.01 13.84,15.24 | 13.84,15.24 15.22,15.24 U1.P$3 | U1.P$3 15.29,13.59 D1.CATHODE | U1.P$3 13.91,15.31 13.84,15.24 | 13.84,15.24 13.84,16.89 14.22,17.27 15.22,17.27 U1.P$1 15.29,19.77 VIN.P$3 VIN.P$2 VIN.P$1
  Bottom 0.254: v12.32,34.16 12.32,30.61 11.68,29.97 11.68,28.45 VIN.P$1

### Text on the board
Top: Mechaduino 0.2 / Joe Church / 2/2/2017
tPlace: SWD | V+ | GND | 1 | 2 | 3 | 4
tStop: Mechaduino 0.2 / Joe Church / 2/2/2017
Reference: Joe Church